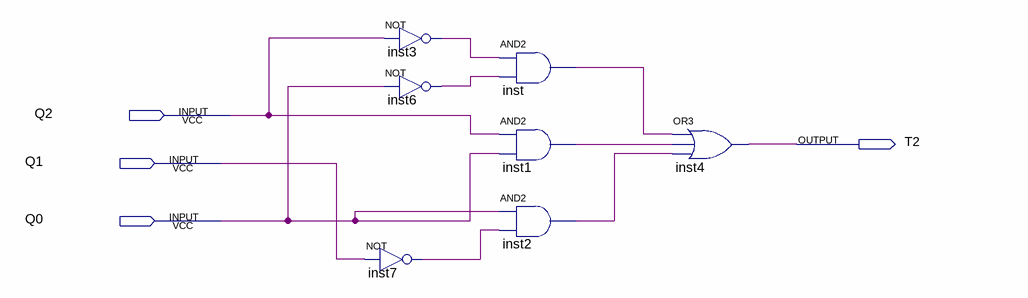
[diagram p0: schematic sheet]
// Quartus schematic T2.bdf as structural Verilog: 7 symbols, 4 pins
module T2 (
  input  Q2,
  input  Q1,
  input  Q0,
  output T2
);

  wire inst1_out, inst2_out, inst3_out, inst6_out, inst7_out, inst_out;

  not inst3 (inst3_out, Q2);
  not inst6 (inst6_out, Q0);
  not inst7 (inst7_out, Q1);
  and inst (inst_out, inst3_out, inst6_out);
  and inst1 (inst1_out, Q2, Q0);
  and inst2 (inst2_out, Q0, inst7_out);
  or inst4 (T2, inst_out, inst1_out, inst2_out);
endmodule
